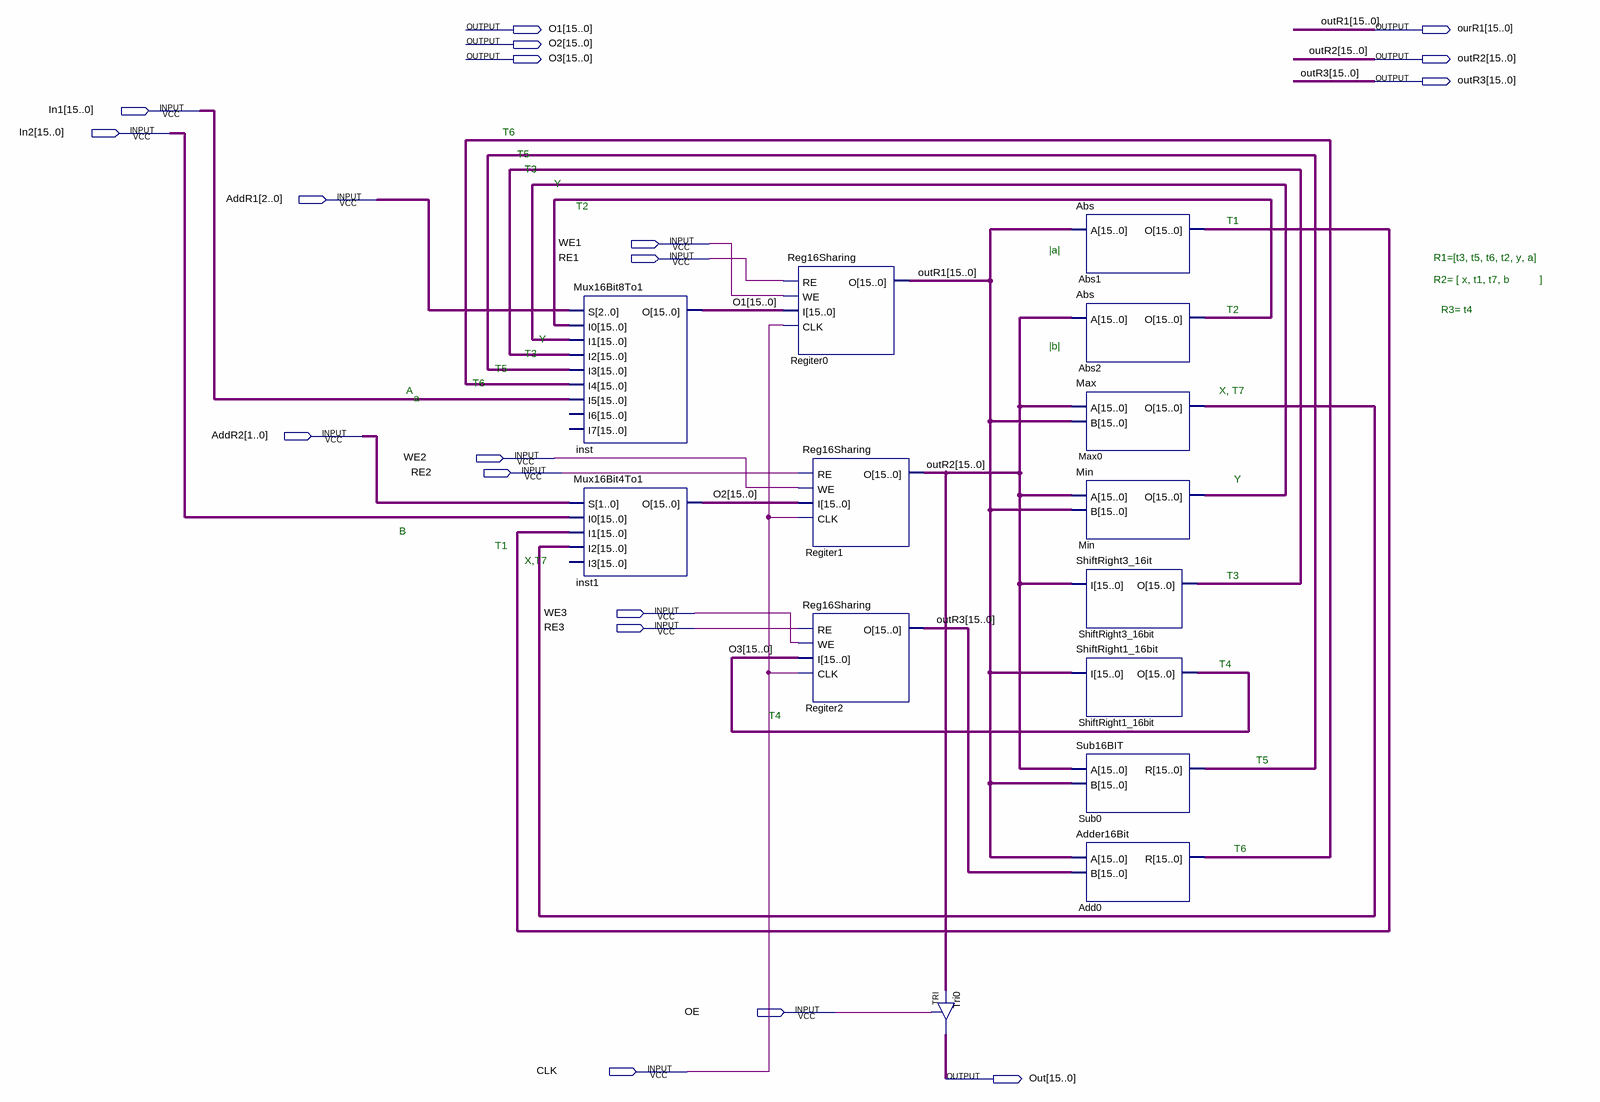
[diagram p0: schematic sheet]
// Quartus schematic RegisterSharingDatapath.bdf as structural Verilog: 14 symbols, 19 pins
module RegisterSharingDatapath (
  input  [15:0] In1,
  input  [15:0] In2,
  input  [2:0] AddR1,
  input  WE1,
  input  RE1,
  input  [1:0] AddR2,
  input  WE2,
  input  RE2,
  input  WE3,
  input  RE3,
  input  OE,
  input  CLK,
  output [15:0] O1,
  output [15:0] ourR1,
  output [15:0] O2,
  output [15:0] O3,
  output [15:0] outR2,
  output [15:0] outR3,
  output [15:0] Out
);

  wire [15:0] Abs1_o, Abs2_o, Add0_r, Max0_o, Min_o, ShiftRight3_16bit_o, Sub0_r;

  Mux16Bit8To1 inst (
    .S(AddR1), .I0(Abs2_o), .I1(Min_o), .I2(ShiftRight3_16bit_o), .I3(Sub0_r), .I4(Add0_r), .I5(In1), .O(O1));  // open: I6, I7
  Mux16Bit4To1 inst1 (.S(AddR2), .I0(In2), .I1(Abs1_o), .I2(Max0_o), .O(O2));  // open: I3
  Reg16Sharing Regiter0 (.RE(RE1), .WE(WE1), .I(O1), .CLK(CLK), .O(ourR1));
  Reg16Sharing Regiter1 (.RE(RE2), .WE(WE2), .I(O2), .CLK(CLK), .O(outR2));
  Reg16Sharing Regiter2 (.RE(RE3), .WE(WE3), .I(O3), .CLK(CLK), .O(outR3));
  TRI Tri0[15:0] (.IN(outR2), .OE(OE), .OUT(Out));
  Abs Abs1 (.A(ourR1), .O(Abs1_o));
  Abs Abs2 (.A(outR2), .O(Abs2_o));
  Max Max0 (.A(outR2), .B(ourR1), .O(Max0_o));
  Min Min (.A(outR2), .B(ourR1), .O(Min_o));
  ShiftRight3_16it ShiftRight3_16bit (.I(outR2), .O(ShiftRight3_16bit_o));
  ShiftRight1_16bit ShiftRight1_16bit (.I(ourR1), .O(O3));
  Sub16BIT Sub0 (.A(outR2), .B(ourR1), .R(Sub0_r));
  Adder16Bit Add0 (.A(ourR1), .B(outR3), .R(Add0_r));

  // Other names for the same wires on the sheet: outR1[15:0] = ourR1

  // Notes on the sheet:
  //   T6
  //   T5
  //   T3
  //   Y
  //   T2
  //   T1
  //   |a|
  //   R1=[t3, t5, t6, t2, y, a]            
  //   R2= [ x, t1, t7, b          ]
  //   T2
  //   R3= t4             
  //   Y
  //   |b|
  //   T3
  //   T5
  //   T6
  //   A
  //   X, T7 
  //   a
  //   Y
  //   B
  //   T1
  //   X,T7
  //   T3
  //   T4
  //   T4
  //   T5
  //   T6
endmodule
